# EAGLE design sensore_temp (EAGLE 9.6.2)
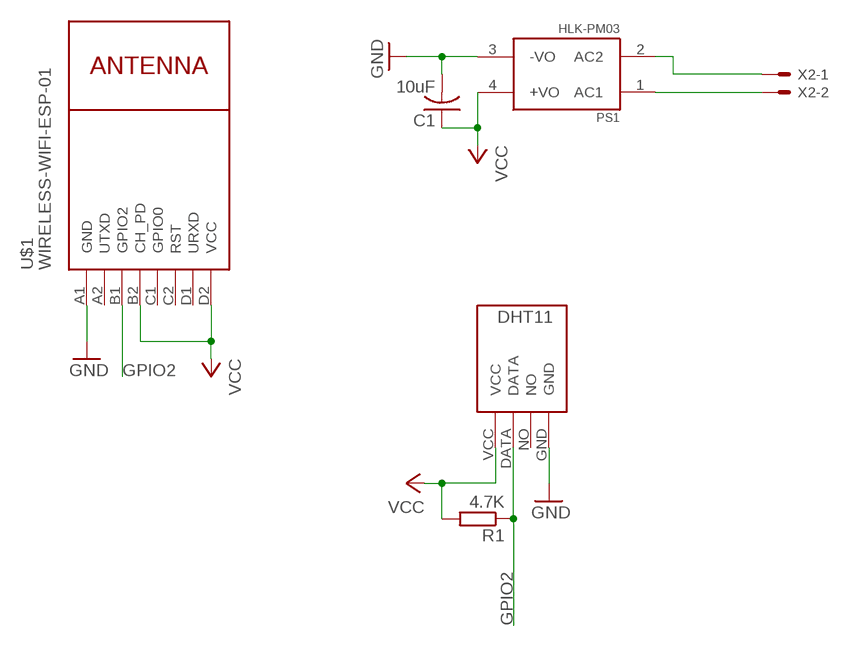
[diagram p0: schematic, sheet 1]

## Parts
C1  10uF  C-US025-025X050  [C025-025X050]
PS1  HLK-PM03  [CONV_HLK-PM03]
R1  4.7K  R-EU_0204/7  [0204/7]
U$1  WIRELESS-WIFI-ESP-01  [WIRELESS-WIFI-ESP-01]
U$2  DHT11  [DHT11]
X2  JST-XH-02-PIN-LONG-PAD  [JST-XH-02-PACKAGE-LONG-PAD]

## Nets
GND: C1.2 PS1.3(-VO) U$1.A1(GND) U$2.GND
GPIO2: R1.1 U$1.B1(GPIO2) U$2.DATA
N$1: PS1.1(AC1) X2.2
N$2: PS1.2(AC2) X2.1
VCC: C1.1 PS1.4(+VO) R1.2 U$1.B2(CH_PD) U$1.D2(VCC) U$2.VCC
Unconnected: U$1.A2(UTXD) U$1.C1(GPIO0) U$1.C2(RST) U$1.D1(URXD) U$2.NO

## Library data of the parts
C1 = adafruit:C-US: CAPACITOR, American symbol
PS1 = HLK-PM03:HLK-PM03: AC DC 3W power module Check availability <https://pricing.snapeda.com/parts/HLK-PM03/Hi-link/view-part?ref=eda>; AVAILABILITY: Not in stock; MF: Hi-link; MP: HLK-PM03; PACKAGE: Package; PRICE: None
R1 = rcl:R-EU_: RESISTOR, European symbol; SPICEPREFIX: R
U$1 = diy-modules:WIRELESS-WIFI-ESP-01: Wireless Wi-Fi ESP-01 Module based on ESP8266 chip Click here to find device on ebay.com <http://www.ebay.com/sch/esp8266+esp+01+transceiver>
U$2 = DHT11:DHT11: DHT11 Czujnik temperatury i wilgotności
X2 = jstConnector-2.5:JST-XH-02-PIN: JST XH Connector 2 Pin Wire to board connector. Pitch: 2,54 mm, (0.100") Number of pins: 2 Created by Rembrandt Electronics www.rembrandtelectronics.com

## Board
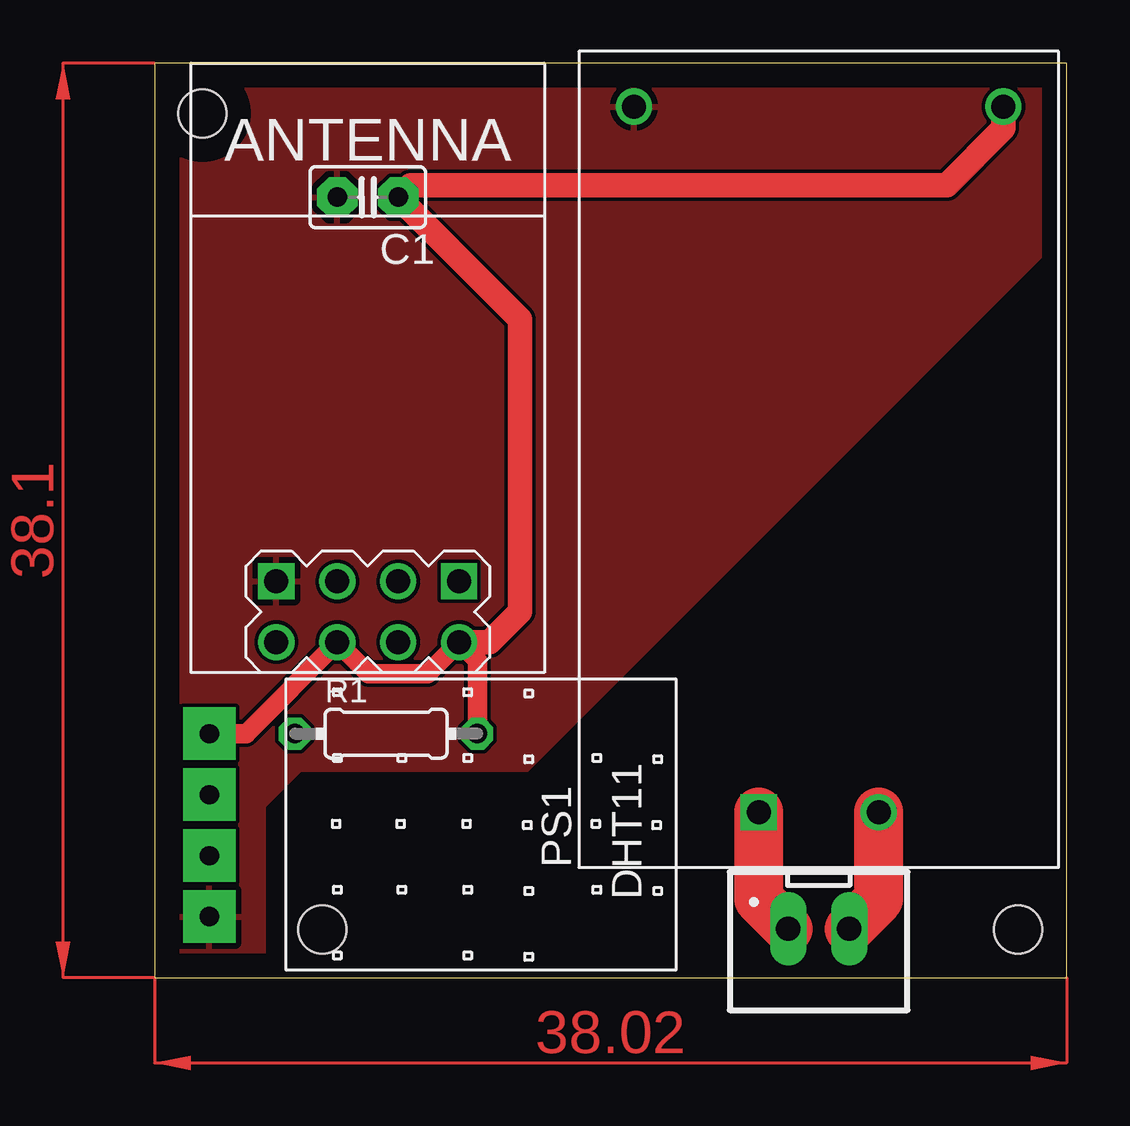
[diagram p1: board, top side]
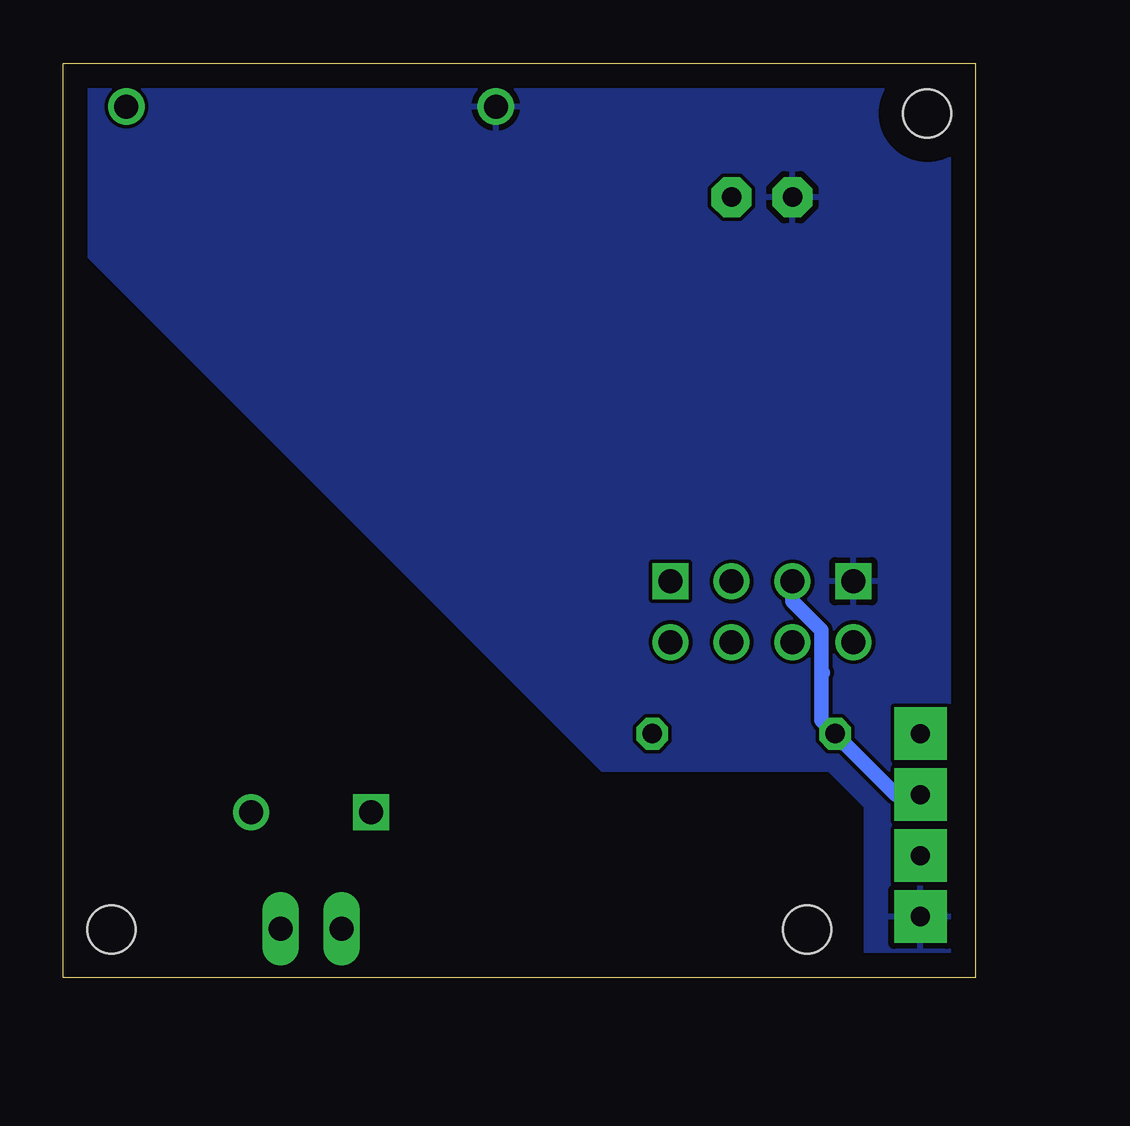
[diagram p2: board, bottom side, seen from below]

Size 38.02 x 38.09 mm. Coordinates in mm from the lower left corner, seen from the top.
Outline: 0,0 38.02,0 38.02,38.09 0,38.09 0,0
Copper layers (1*16): Top 0.035mm / dielectric 1.5mm / Bottom 0.035mm
Design rules "default": minimum track width 6mil, minimum drill 0.35mm, track to track 6mil, track to pad 6mil, pad to pad 6mil, via to via 6mil, smd to smd 6mil, copper to edge 40mil, drill to drill 6mil, minimum pad ring 10mil, minimum via ring 8mil, stop-mask expansion 4mil, vias tented up to drill 0mil, thermal gap 10mil
Holes 2 mm at 2,36 36,2 7,2

### Footprints (pad centres in the part's own frame; a part is rotated, then mirrored left to right if it is on the bottom)
C025-025X050 = drill 0.813 pad 1.676 octagon: 1 -1.27,0; 2 1.27,0
CONV_HLK-PM03 = drill 1 square: 1 -14.7,2.5 | drill 1: 2 -14.7,-2.5; 3 14.7,7.7; 4 14.7,-7.7
0204/7 = drill 0.813 octagon: 1 -3.81,0; 2 3.81,0
WIRELESS-WIFI-ESP-01 = drill 1 square: A1 -8.89,3.81; D1 -8.89,-3.81 | drill 1: A2 -11.43,3.81; B1 -8.89,1.27; B2 -11.43,1.27; C1 -8.89,-1.27; C2 -11.43,-1.27; D2 -11.43,-3.81
DHT11 = drill 0.8 pad 2.184 square: DATA -1.27,-11.43; GND 3.81,-11.43; NO 1.27,-11.43; VCC -3.81,-11.43
JST-XH-02-PACKAGE-LONG-PAD = drill 1.016 long: 1 -1.27,0; 2 1.27,0

### Placement (x,y rotation side)
C1  8.89,32.51 180 top
PS1  27.69,21.59 90 top
R1  9.65,10.16 0 top
U$1  8.89,25.4 90 top
U$2  13.72,6.35 270 top
X2  27.69,2.03 180 top

### Tracks (layer width: path | path; a pad name or v marks a point on that pad's centre or on a via)
GND
  pour Top: -1.52,40.13 20.57,40.13 39.83,59.39 39.83,32.91 15.56,8.64 6.1,8.64 4.57,7.11 4.57,-1.78 -1.27,-1.78 -1.52,-2.03
  pour Bottom: 4.57,-1.78 4.57,7.11 6.1,8.64 15.56,8.64 38.83,31.91 38.83,40.13 -1.52,40.13 -1.52,-1.52 -1.27,-1.78
GPIO2
  Bottom 0.61: U$1.B1 7.62,15.68 6.41,14.47 6.41,12.76 | 6.35,12.7 6.41,12.76 | 6.41,12.76 6.41,10.73 R1.1 3.3,7.62 U$2.DATA
N$1
  Top 2.032: X2.2 25.19,3.26 PS1.1
N$2
  Top 2.032: X2.1 30.19,3.26 PS1.2
VCC
  Top 0.813: U$2.VCC 3.81,10.16 U$1.B2 8.93,12.66 11.39,12.66 U$1.D2 13.46,13.21 R1.2
  Top 1.016: PS1.4 35.39,35.39 33.02,33.02 10.67,33.02 C1.1 15.24,27.43 15.24,15.24 13.97,13.97 U$1.D2
(copper drawn outside any net)
  shapes: Top area x2

### Text on the board
tTest: sensore temperatura v2.0 | Il garage del Bicchio | JLCJLCJLCJLC